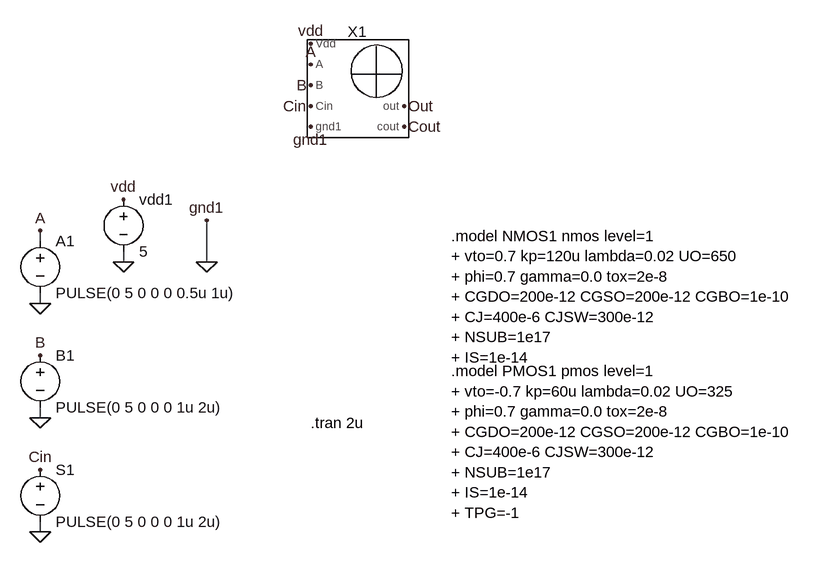
[diagram p0: schematic Full_adder_tb.asc]
Full_adder_tb.asc, the LTspice schematic file:
Version 4.1
SHEET 1 880 756
WIRE -1008 288 -1008 272
WIRE -880 320 -880 304
WIRE -752 320 -752 256
WIRE -1008 384 -1008 368
WIRE -1008 560 -1008 544
WIRE -1008 736 -1008 720
FLAG -880 320 0
FLAG -1008 384 0
FLAG -1008 560 0
FLAG -880 224 vdd
FLAG -1008 272 A
FLAG -1008 464 B
FLAG -752 320 0
FLAG -752 256 gnd1
FLAG -592 -16 vdd
FLAG -448 80 Out
FLAG -592 112 gnd1
FLAG -592 80 Cin
FLAG -592 48 B
FLAG -1008 736 0
FLAG -1008 640 Cin
FLAG -592 16 A
FLAG -448 112 Cout
SYMBOL full_adder -528 48 R0
SYMATTR InstName X1
SYMBOL voltage -1008 448 R0
WINDOW 123 0 0 Left 0
WINDOW 39 0 0 Left 0
SYMATTR InstName B1
SYMATTR Value PULSE(0 5 0 0 0 1u 2u)
SYMBOL voltage -1008 272 R0
WINDOW 123 0 0 Left 0
WINDOW 39 0 0 Left 0
SYMATTR InstName A1
SYMATTR Value PULSE(0 5 0 0 0 0.5u 1u)
SYMBOL voltage -880 208 R0
SYMATTR InstName vdd1
SYMATTR Value 5
SYMBOL voltage -1008 624 R0
WINDOW 123 0 0 Left 0
WINDOW 39 0 0 Left 0
SYMATTR InstName S1
SYMATTR Value PULSE(0 5 0 0 0 1u 2u)
TEXT -376 280 Left 2 !.model NMOS1 nmos level=1\n+ vto=0.7 kp=120u lambda=0.02 UO=650\n+ phi=0.7 gamma=0.0 tox=2e-8\n+ CGDO=200e-12 CGSO=200e-12 CGBO=1e-10\n+ CJ=400e-6 CJSW=300e-12\n+ NSUB=1e17\n+ IS=1e-14
TEXT -376 488 Left 2 !.model PMOS1 pmos level=1\n+ vto=-0.7 kp=60u lambda=0.02 UO=325\n+ phi=0.7 gamma=0.0 tox=2e-8\n+ CGDO=200e-12 CGSO=200e-12 CGBO=1e-10\n+ CJ=400e-6 CJSW=300e-12\n+ NSUB=1e17\n+ IS=1e-14\n+ TPG=-1
TEXT -592 568 Left 2 !.tran 2u

The netlist it stands for:
* Full_adder_tb.asc
X§X1 A B Cin Cout 0 Out vdd full_adder  ; pins A B Cin cout gnd1 out Vdd
V§B1 B 0 PULSE(0 5 0 0 0 1u 2u)
V§A1 A 0 PULSE(0 5 0 0 0 0.5u 1u)
vdd1 vdd 0 5
V§S1 Cin 0 PULSE(0 5 0 0 0 1u 2u)
.model NMOS1 nmos level=1
+ vto=0.7 kp=120u lambda=0.02 UO=650
+ phi=0.7 gamma=0.0 tox=2e-8
+ CGDO=200e-12 CGSO=200e-12 CGBO=1e-10
+ CJ=400e-6 CJSW=300e-12
+ NSUB=1e17
+ IS=1e-14
.model PMOS1 pmos level=1
+ vto=-0.7 kp=60u lambda=0.02 UO=325
+ phi=0.7 gamma=0.0 tox=2e-8
+ CGDO=200e-12 CGSO=200e-12 CGBO=1e-10
+ CJ=400e-6 CJSW=300e-12
+ NSUB=1e17
+ IS=1e-14
+ TPG=-1
.tran 2u
.backanno
.end